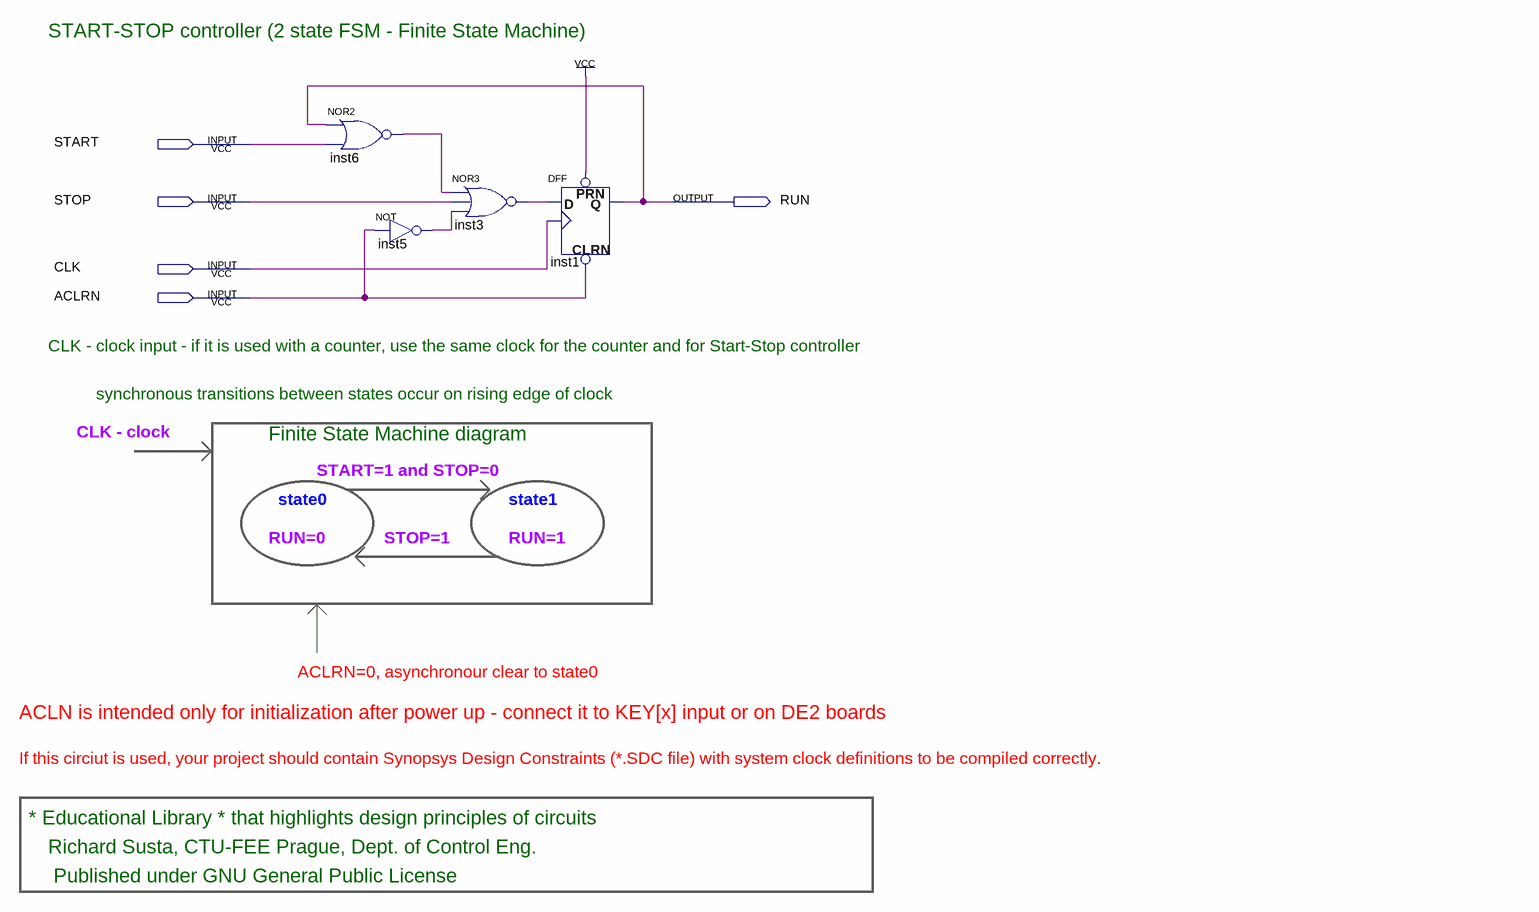
[diagram p0: schematic sheet]
// Quartus schematic start_stop.bdf as structural Verilog: 4 symbols, 5 pins
module start_stop (
  input  START,
  input  STOP,
  input  CLK,
  input  ACLRN,
  output RUN
);

  wire inst3_out, inst5_out, inst6_out;

  nor inst6 (inst6_out, RUN, START);
  not inst5 (inst5_out, ACLRN);
  nor inst3 (inst3_out, inst6_out, STOP, inst5_out);
  DFF inst1 (.CLRN(ACLRN), .CLK(CLK), .D(inst3_out), .PRN(1'b1), .Q(RUN));

  // Notes on the sheet:
  //   START-STOP controller (2 state FSM - Finite State Machine)
  //   CLK - clock input - if it is used with a counter, use the same clock for the counter and for Start-Stop controller
  //   synchronous transitions between states occur on rising edge of clock
  //   CLK - clock
  //   Finite State Machine diagram
  //   START=1 and STOP=0
  //   state0
  //   state1
  //   RUN=0
  //   STOP=1
  //   RUN=1
  //   ACLRN=0, asynchronour clear to state0
  //   ACLN is intended only for initialization after power up - connect it to KEY[x] input or on DE2 boards
  //   If this circiut is used, your project should contain Synopsys Design Constraints (*.SDC file) with system clock definitions to be compiled correctly.
  //   * Educational Library * that highlights design principles of circuits
  //   Richard Susta, CTU-FEE Prague, Dept. of Control Eng. 
  //    Published under GNU General Public License
endmodule
